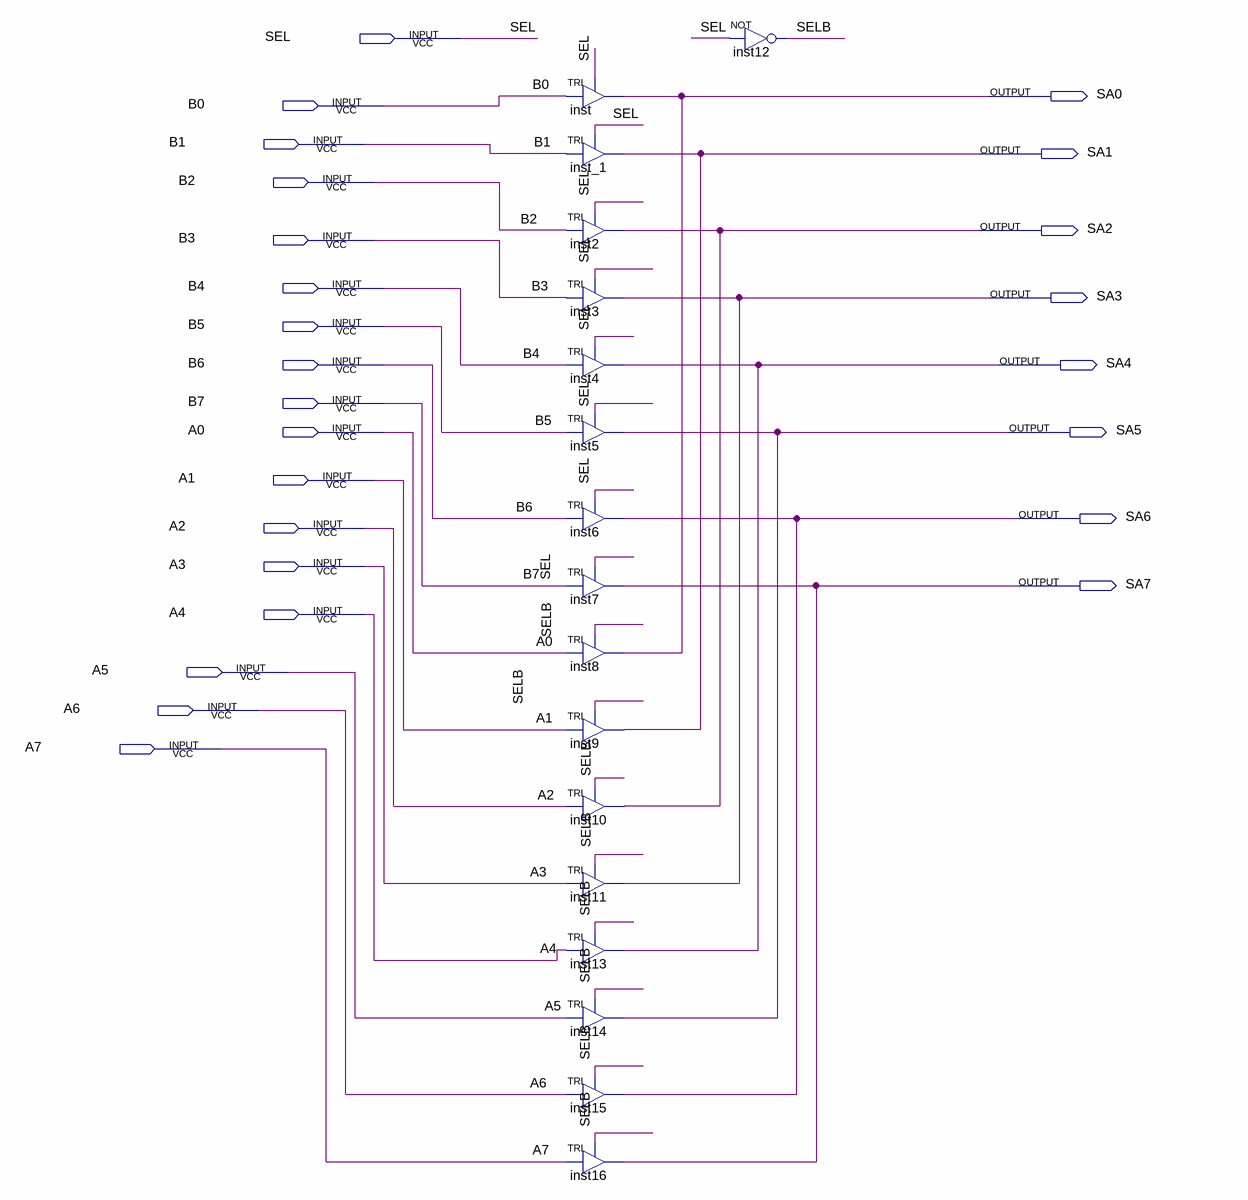
[diagram p0: schematic sheet]
// Quartus schematic MUX_2.bdf as structural Verilog: 17 symbols, 25 pins
module MUX_2 (
  input  SEL,
  input  B0,
  input  B1,
  input  B2,
  input  B3,
  input  B4,
  input  B5,
  input  B6,
  input  B7,
  input  A0,
  input  A1,
  input  A2,
  input  A3,
  input  A4,
  input  A5,
  input  A6,
  input  A7,
  output SA0,
  output SA1,
  output SA2,
  output SA3,
  output SA4,
  output SA5,
  output SA6,
  output SA7
);

  wire SELB;

  TRI inst (.IN(B0), .OE(SEL), .OUT(SA0));
  TRI inst_1 (.IN(B1), .OE(SEL), .OUT(SA1));
  TRI inst2 (.IN(B2), .OE(SEL), .OUT(SA2));
  TRI inst3 (.IN(B3), .OE(SEL), .OUT(SA3));
  TRI inst4 (.IN(B4), .OE(SEL), .OUT(SA4));
  TRI inst5 (.IN(B5), .OE(SEL), .OUT(SA5));
  TRI inst6 (.IN(B6), .OE(SEL), .OUT(SA6));
  TRI inst7 (.IN(B7), .OE(SEL), .OUT(SA7));
  TRI inst8 (.IN(A0), .OE(SELB), .OUT(SA0));
  TRI inst9 (.IN(A1), .OE(SELB), .OUT(SA1));
  TRI inst10 (.IN(A2), .OE(SELB), .OUT(SA2));
  TRI inst11 (.IN(A3), .OE(SELB), .OUT(SA3));
  TRI inst13 (.IN(A4), .OE(SELB), .OUT(SA4));
  TRI inst14 (.IN(A5), .OE(SELB), .OUT(SA5));
  TRI inst15 (.IN(A6), .OE(SELB), .OUT(SA6));
  TRI inst16 (.IN(A7), .OE(SELB), .OUT(SA7));
  not inst12 (SELB, SEL);
endmodule
